# Altium schematic sheet Interface_Current_Sensor_2.SchDoc
size A3; SPICEModelCacheQYDFTYGO: <root> / <DocumentId>QYDFTYGO</DocumentId> / </root>
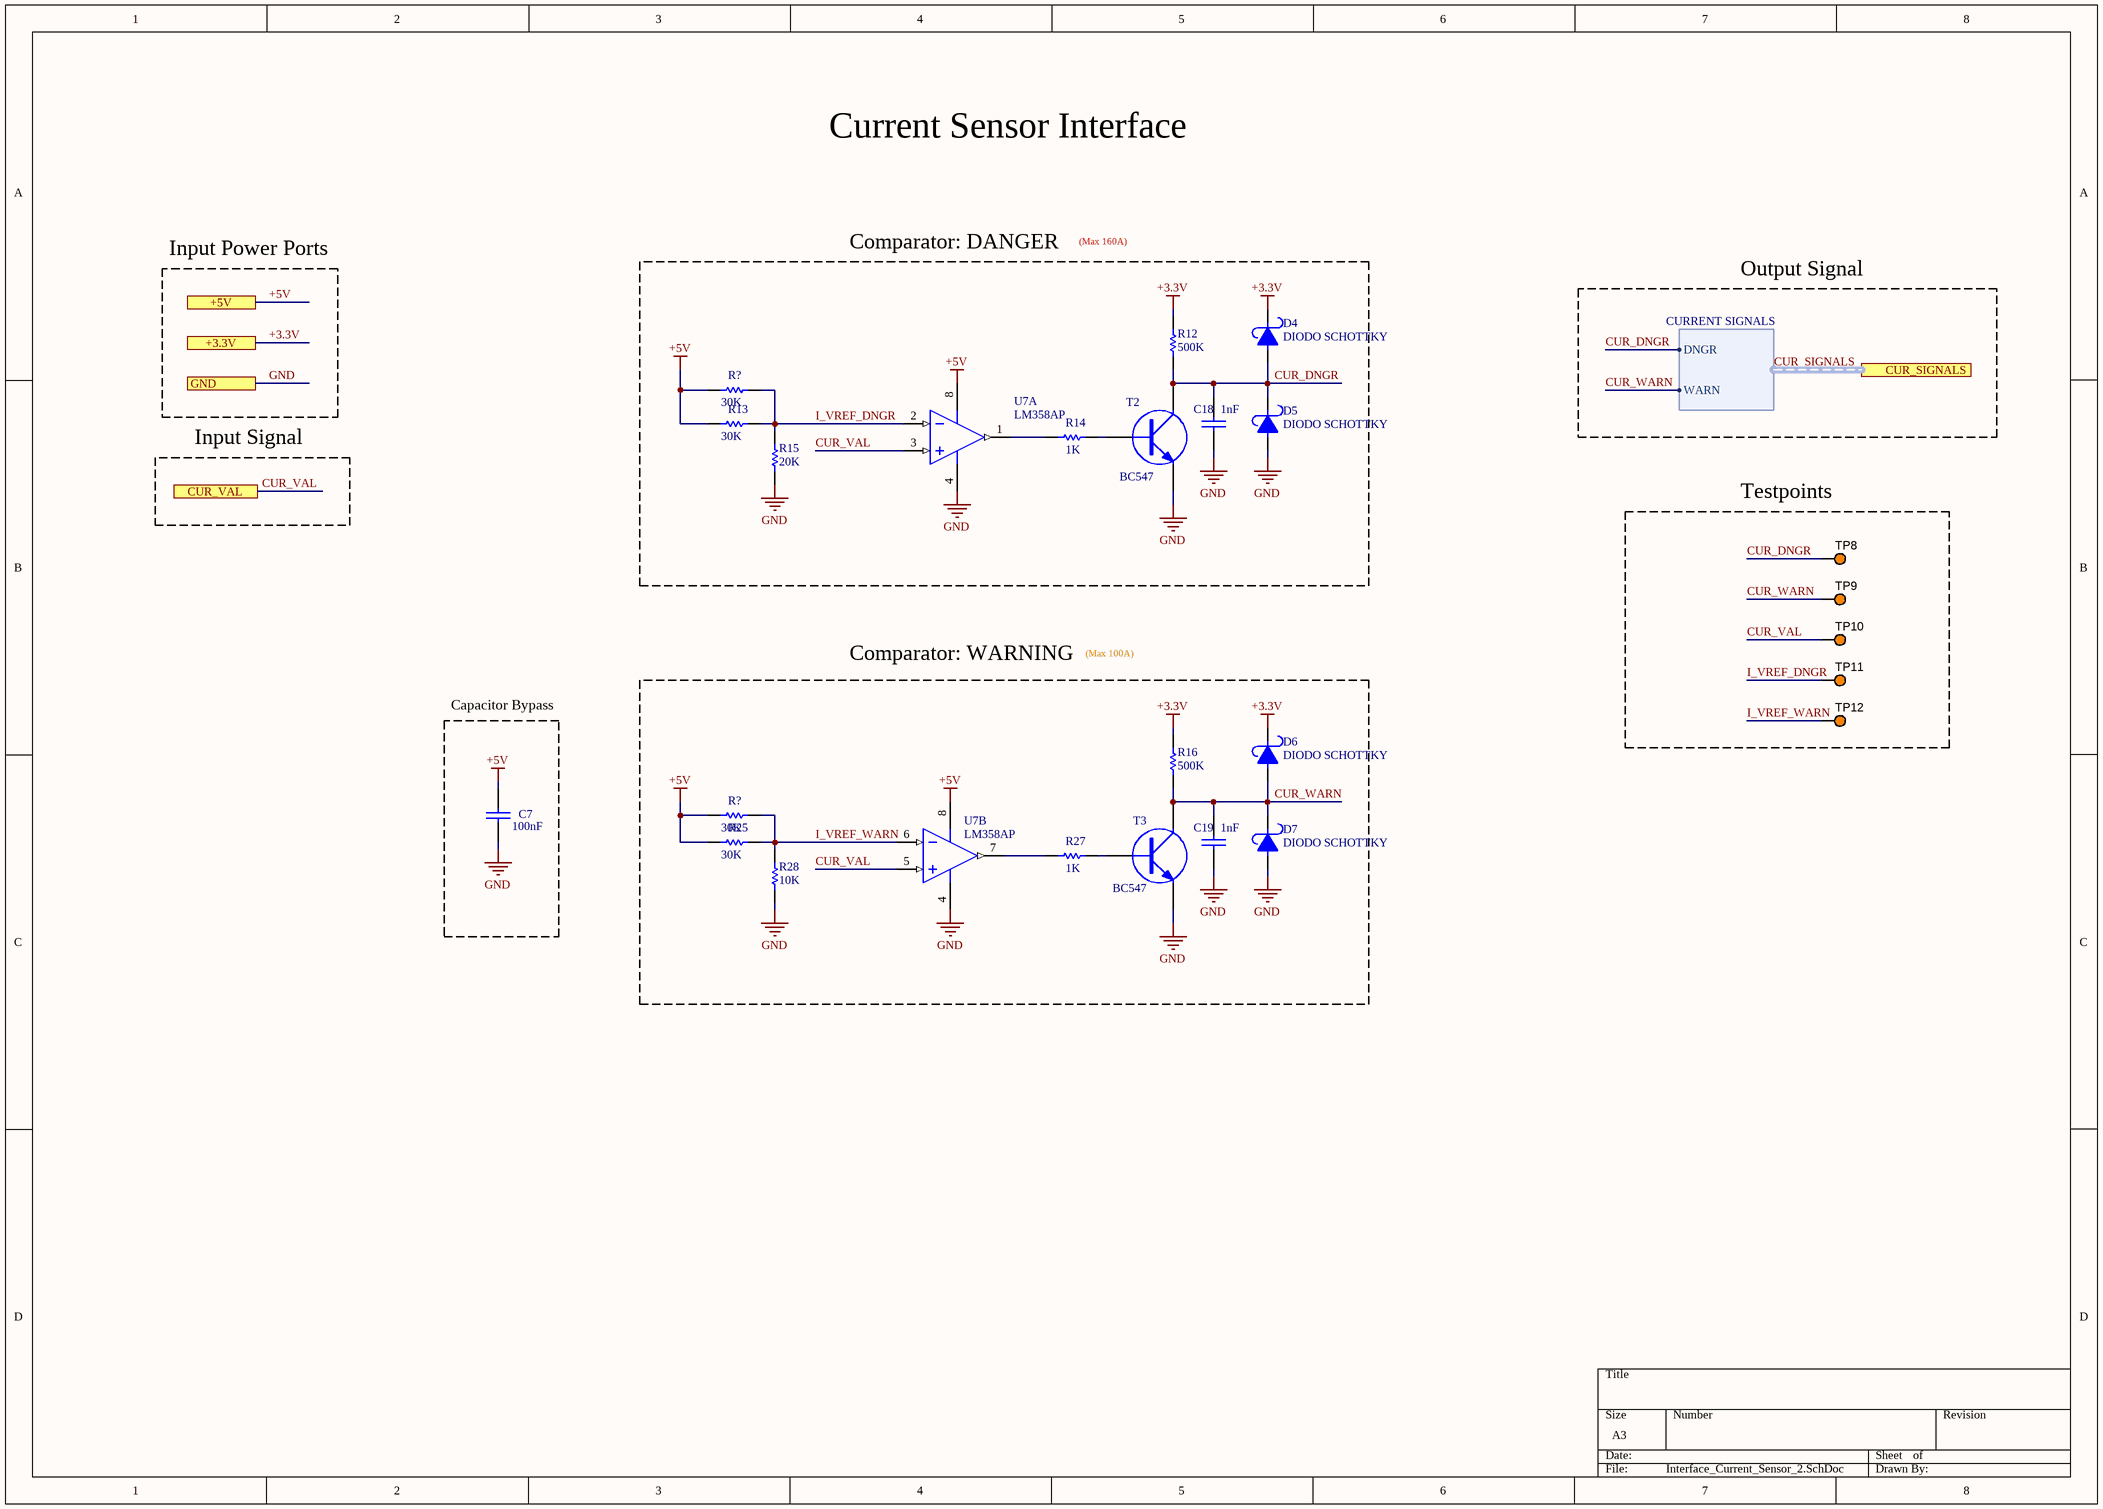
[diagram p0: Interface_Current_Sensor_2.SchDoc]

## Parts
(Parts that share a designator on the sheet are numbered #1, #2 ... from top to bottom, then left to right.)
C7  100nF  [CAP200]
C18  1nF  [CAP200]
C19  1nF  [CAP200]
D4  DIODO SCHOTTKY  [DO41]
D5  DIODO SCHOTTKY  [DO41]
D6  DIODO SCHOTTKY  [DO41]
D7  DIODO SCHOTTKY  [DO41]
R12  500K  [RES400]
R13  30K  [RES400]
R14  1K  [RES400]
R15  20K  [RES400]
R16  500K  [RES400]
R25  30K  [RES400]
R27  1K  [RES400]
R28  10K  [RES400]
R?#1  30K  [RES400]
R?#2  30K  [RES400]
T2  BC547  [TO92]
T3  BC547  [TO92]
TP8  5003  [KSTN-5003]  (value not drawn)
TP9  5003  [KSTN-5003]  (value not drawn)
TP10  5003  [KSTN-5003]  (value not drawn)
TP11  5003  [KSTN-5003]  (value not drawn)
TP12  5003  [KSTN-5003]  (value not drawn)
U7  LM358AP  [P0008A]  (parts A,B of 2)

## Blocks framed on the sheet
Comparator: DANGER: C18 D4 D5 R12-R15 R?#1 T2 U7
Testpoints: TP8-TP12
Comparator: WARNING: C19 D6 D7 R16 R25 R27 R28 R?#2 T3 U7
Capacitor Bypass: C7

## Ports
+3.3V, +5V, CUR_SIGNALS (harness CURRENT SIGNALS), CUR_VAL, GND

## Harnesses
CURRENT SIGNALS: DNGR, WARN

## Nets
+3.3V: D4.2 D6.2 R12.2 R16.2 ; port +3.3V
+5V: C7.1 R13.1 R25.1 R?#1.1 R?#2.1 U7.8(VCC) ; port +5V
GND: C7.2 C18.2 C19.2 D5.1 D7.1 R15.1 R28.1 T2.3(E) T3.3(E) U7.4(GND) ; port GND
CUR_DNGR: C18.1 D4.1 D5.2 R12.1 T2.2(C) TP8.1 ; port CUR_SIGNALS.DNGR
CUR_VAL: TP10.1 U7.3(1IN+) U7.5(2IN+) ; port CUR_VAL
CUR_WARN: C19.1 D6.1 D7.2 R16.1 T3.2(C) TP9.1 ; port CUR_SIGNALS.WARN  [project net CUR_SIGNALS.WARN]
I_VREF_DNGR: R13.2 R15.2 R?#1.2 TP11.1 U7.2(1IN-)
I_VREF_WARN: R25.2 R28.2 R?#2.2 TP12.1 U7.6(2IN-)
NetR14_1: R14.1 U7.1(1OUT)
NetR14_2: R14.2 T2.1(B)
NetR27_1: R27.1 U7.7(2OUT)
NetR27_2: R27.2 T3.1(B)

## Buses and harness runs
harness CUR_SIGNALS = port CUR_SIGNALS

## Notes on the sheet
- Current Sensor Interface
- (Max 160A)
- Input Power Ports
- Output Signal
- Input Signal
- (Max 100A)

## Library data of the parts
C7 C18 C19 = CAP
R12-R16 R25 R27 R28 R?#1 R?#2 = CMP-009-00195-1: Component Type: Standard; Source: Schematics.SchLib; Pins: 2; Design Item ID: RES
T2 T3 = CMP-012-00019-1: Component Type: Standard; Source: Schematics.SchLib; Design Item ID: TRANSISTOR NPN; Pins: 3
TP8-TP12 = CMP-002-00037-2: Test Point, Orange, Height 4.6 mm, Tail Length 3 mm, 1-Pin THD, RoHS; Manufacturer: Keystone; Colour: Orange; Packaging: Bulk; Package Description: 1-Pin Through Hole Device, Dia 2.54 mm; Pins: 1; Package Reference: 5003; Datasheet Version: Jun-15; Case/Package: 5003; Mounting Technology: TH; Connector Type: TestPoint; Diameter: 2.54mm; Contact Material: Bronze; Datasheet URL: http://keyelco.com/userAssets/file/M65p56.pdf; Manufacturer URL: http://www.keyelco.com/; Package Quantity: 10; Contact Plating: Tin; RoHS Compliant: True
U7 = CMP-014-00023-2: Dual Operational Amplifier, 3 to 32 V, 0 to 70 degC, 8-Pin PDIP (P), Pb-Free (RoHS), Tube; Manufacturer: Texas Instruments (TI); Channels: 2; Max Dual Supply Voltage: 16V; Min Dual Supply Voltage: 1.5V; Slew Rate: 0.3V/us; Unity Gain Bandwidth Product: 700KHz; Common Mode Rejection Ratio: 65dB; Nominal Supply Voltage: 5V; Package Version: 4040082/E, 04/2010; Output Current: 30mA; Nominal Supply Current: 1.2mA; Nominal Voltage Gain: 100dB; Case/Package: DIP; Max Operating Temperature: 70°C; RoHS Compliant: True; Manufacturer URL: http://www.ti.com/; Pins: 8; Package Description: 8-Pin Double In-line Package, Body 9.59 x 6.35 mm, Pitch 2.54 mm; Datasheet URL: http://www.ti.com/lit/ds/symlink/lm358a.pdf; Max Supply Voltage: 16V; Package Reference: P0008A; Mounting Technology: TH; Min Operating Temperature: 0°C; Package URL: http://www.ti.com/lit/ml/mpdi001b/mpdi001b.pdf; Min Supply Voltage: 1.5V; Package Quantity: 50; Packaging: Rail/Tube; Datasheet Version: SLOS068T, 04/2015; Nominal Gain Bandwith Product: 700KHz